# EAGLE design evalboard (EAGLE 7.2.0)
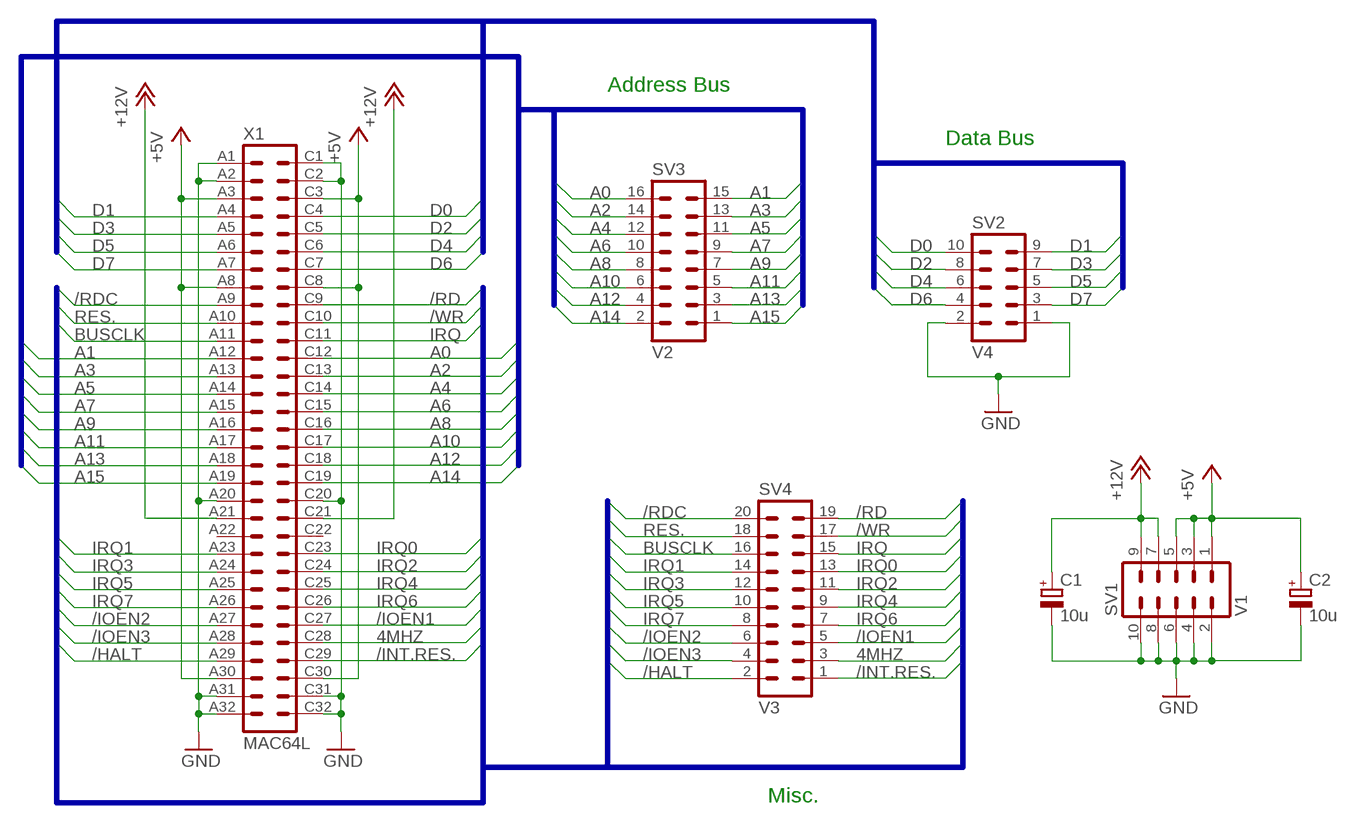
[diagram p0: schematic, sheet 1]

## Parts
C1  10u  CPOL-EUE2.5-5  [E2,5-5]
C2  10u  CPOL-EUE2.5-5  [E2,5-5]
SV1  V1  ML10L  [ML10L]
SV2  V4  ML10L  [ML10L]
SV3  V2  ML16L  [ML16L]
SV4  V3  ML20L  [ML20L]
X1  MAC64L  [MAC64L]

## Nets
4MHZ: SV4.3 X1.C28
+5V: C2.+ SV1.1 SV1.3 SV1.5 X1.A3 X1.A8 X1.A30 X1.C3 X1.C8 X1.C30
+12V: C1.+ SV1.7 SV1.9 X1.A21 X1.C21
/HALT: SV4.2 X1.A29
/INT.RES.: SV4.1 X1.C29
/IOEN1: SV4.5 X1.C27
/IOEN2: SV4.6 X1.A27
/IOEN3: SV4.4 X1.A28
/RD: SV4.19 X1.C9
/RDC: SV4.20 X1.A9
/WR: SV4.17 X1.C10
A0: SV3.16 X1.C12
A1: SV3.15 X1.A12
A2: SV3.14 X1.C13
A3: SV3.13 X1.A13
A4: SV3.12 X1.C14
A5: SV3.11 X1.A14
A6: SV3.10 X1.C15
A7: SV3.9 X1.A15
A8: SV3.8 X1.C16
A9: SV3.7 X1.A16
A10: SV3.6 X1.C17
A11: SV3.5 X1.A17
A12: SV3.4 X1.C18
A13: SV3.3 X1.A18
A14: SV3.2 X1.C19
A15: SV3.1 X1.A19
BUSCLK: SV4.16 X1.A11
D0: SV2.10 X1.C4
D1: SV2.9 X1.A4
D2: SV2.8 X1.C5
D3: SV2.7 X1.A5
D4: SV2.6 X1.C6
D5: SV2.5 X1.A6
D6: SV2.4 X1.C7
D7: SV2.3 X1.A7
GND: C1.- C2.- SV1.2 SV1.4 SV1.6 SV1.8 SV1.10 SV2.1 SV2.2 X1.A1 X1.A2 X1.A20 X1.A31 X1.A32 X1.C1 X1.C2 X1.C20 X1.C31 X1.C32
IRQ: SV4.15 X1.C11
IRQ0: SV4.13 X1.C23
IRQ1: SV4.14 X1.A23
IRQ2: SV4.11 X1.C24
IRQ3: SV4.12 X1.A24
IRQ4: SV4.9 X1.C25
IRQ5: SV4.10 X1.A25
IRQ6: SV4.7 X1.C26
IRQ7: SV4.8 X1.A26
RES.: SV4.18 X1.A10
Unconnected: X1.A22 X1.C22

## Buses
A[0..15]
D[0..7]
/RDC,/RD,RES.,/WR,BUSCLK,IRQ,IRQ[0..7],/IOEN[1..3],4MHZ,/HALT,/INT.RES.

## Notes on the sheet
- Address Bus
- Data Bus
- Misc.

## Library data of the parts
C1 C2 = rcl:CPOL-EU: POLARIZED CAPACITOR, European symbol
SV1 SV2 = con-harting-ml:ML10: HARTING; OC_FARNELL: unknown; OC_NEWARK: unknown
SV3 = con-harting-ml:ML16: HARTING; OC_FARNELL: unknown; OC_NEWARK: unknown
SV4 = con-harting-ml:ML20: HARTING; OC_FARNELL: unknown; OC_NEWARK: unknown
X1 = con-vg:MAC64L: CONNECTOR male, 64 pins, block, type C, rows AC, grid 5.08 mm

## Board
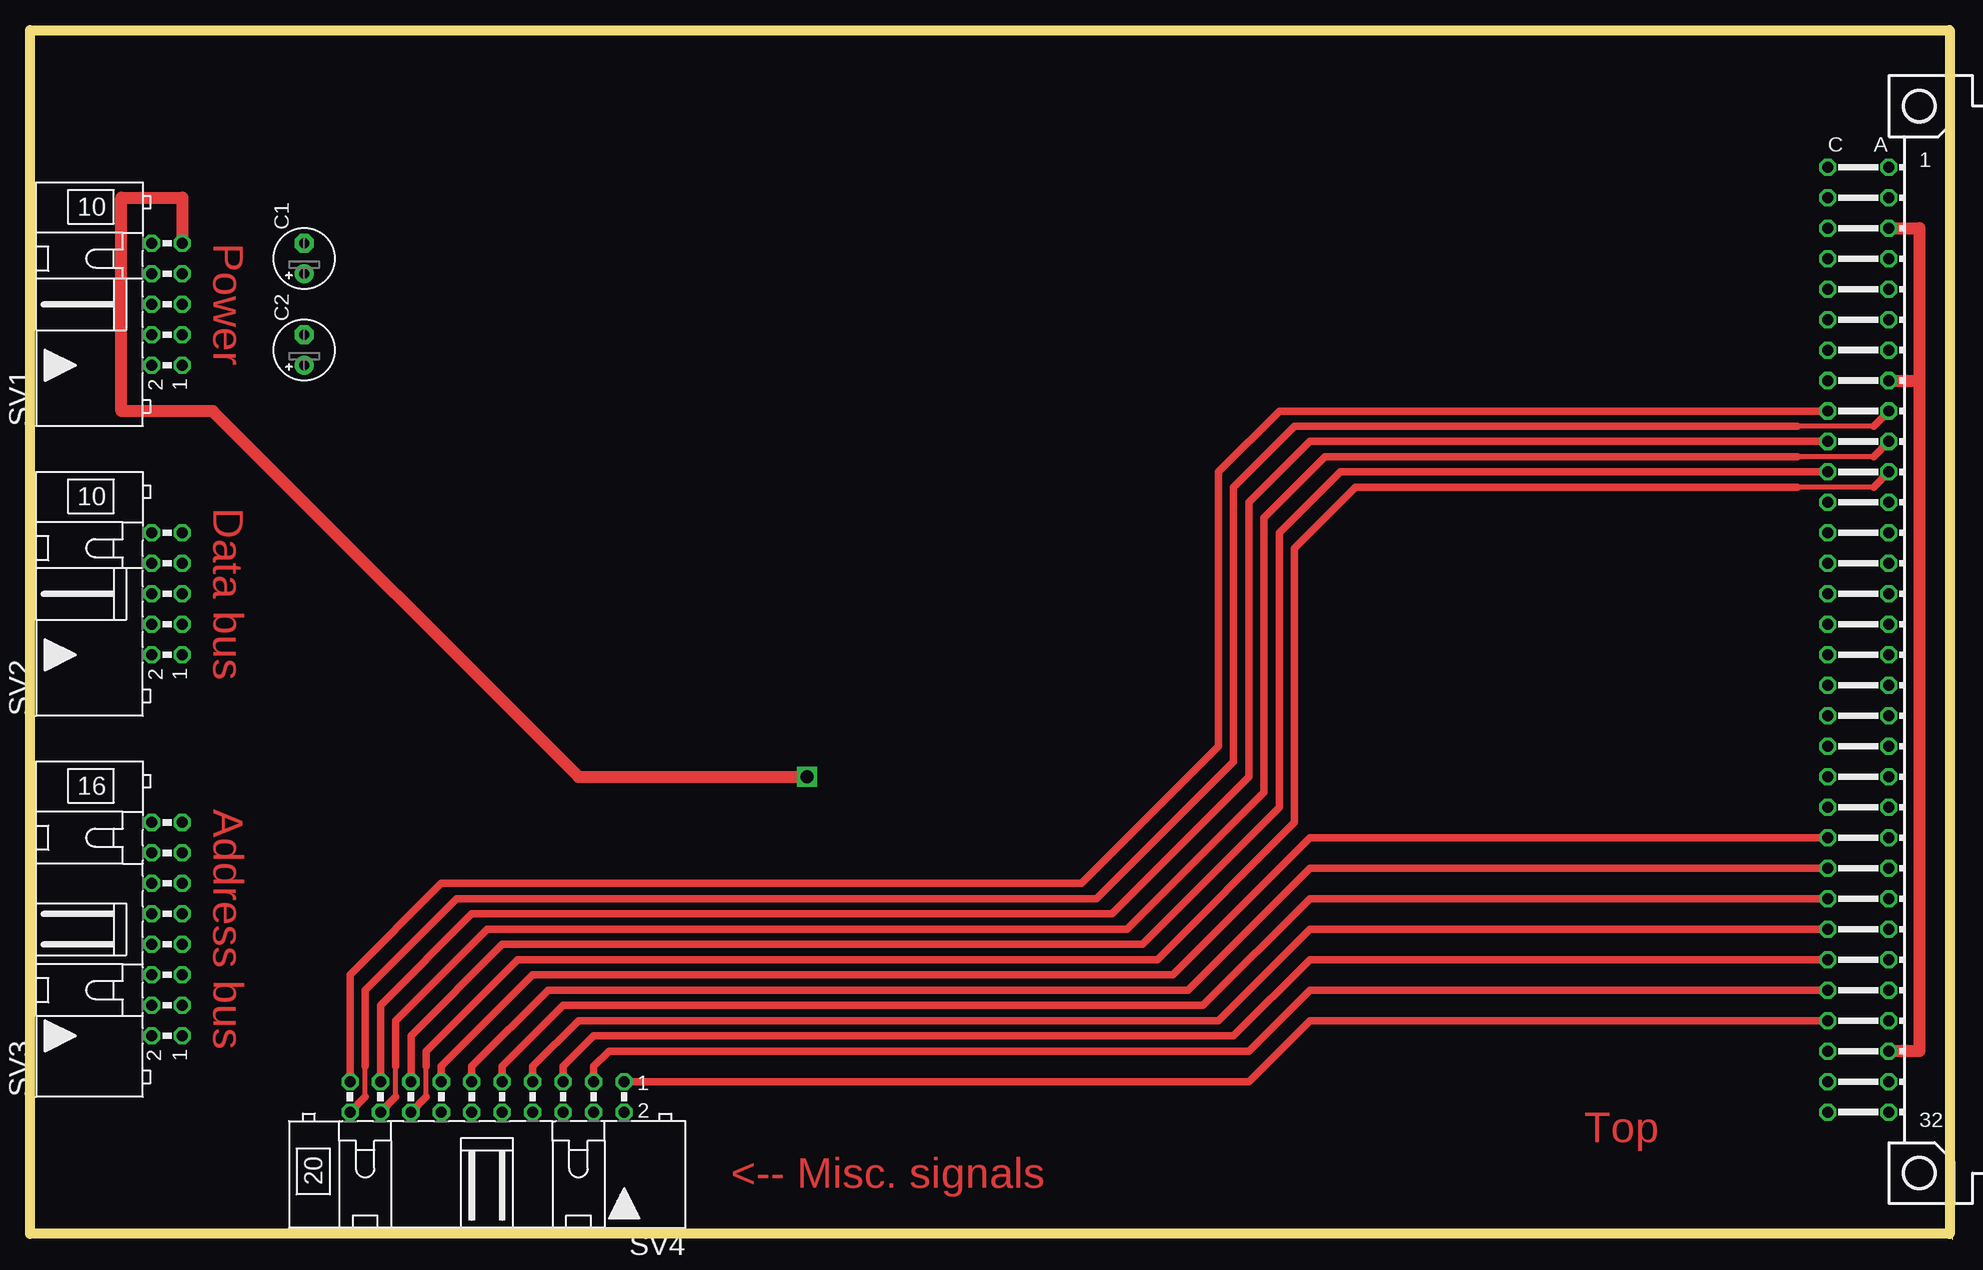
[diagram p1: board, top side]
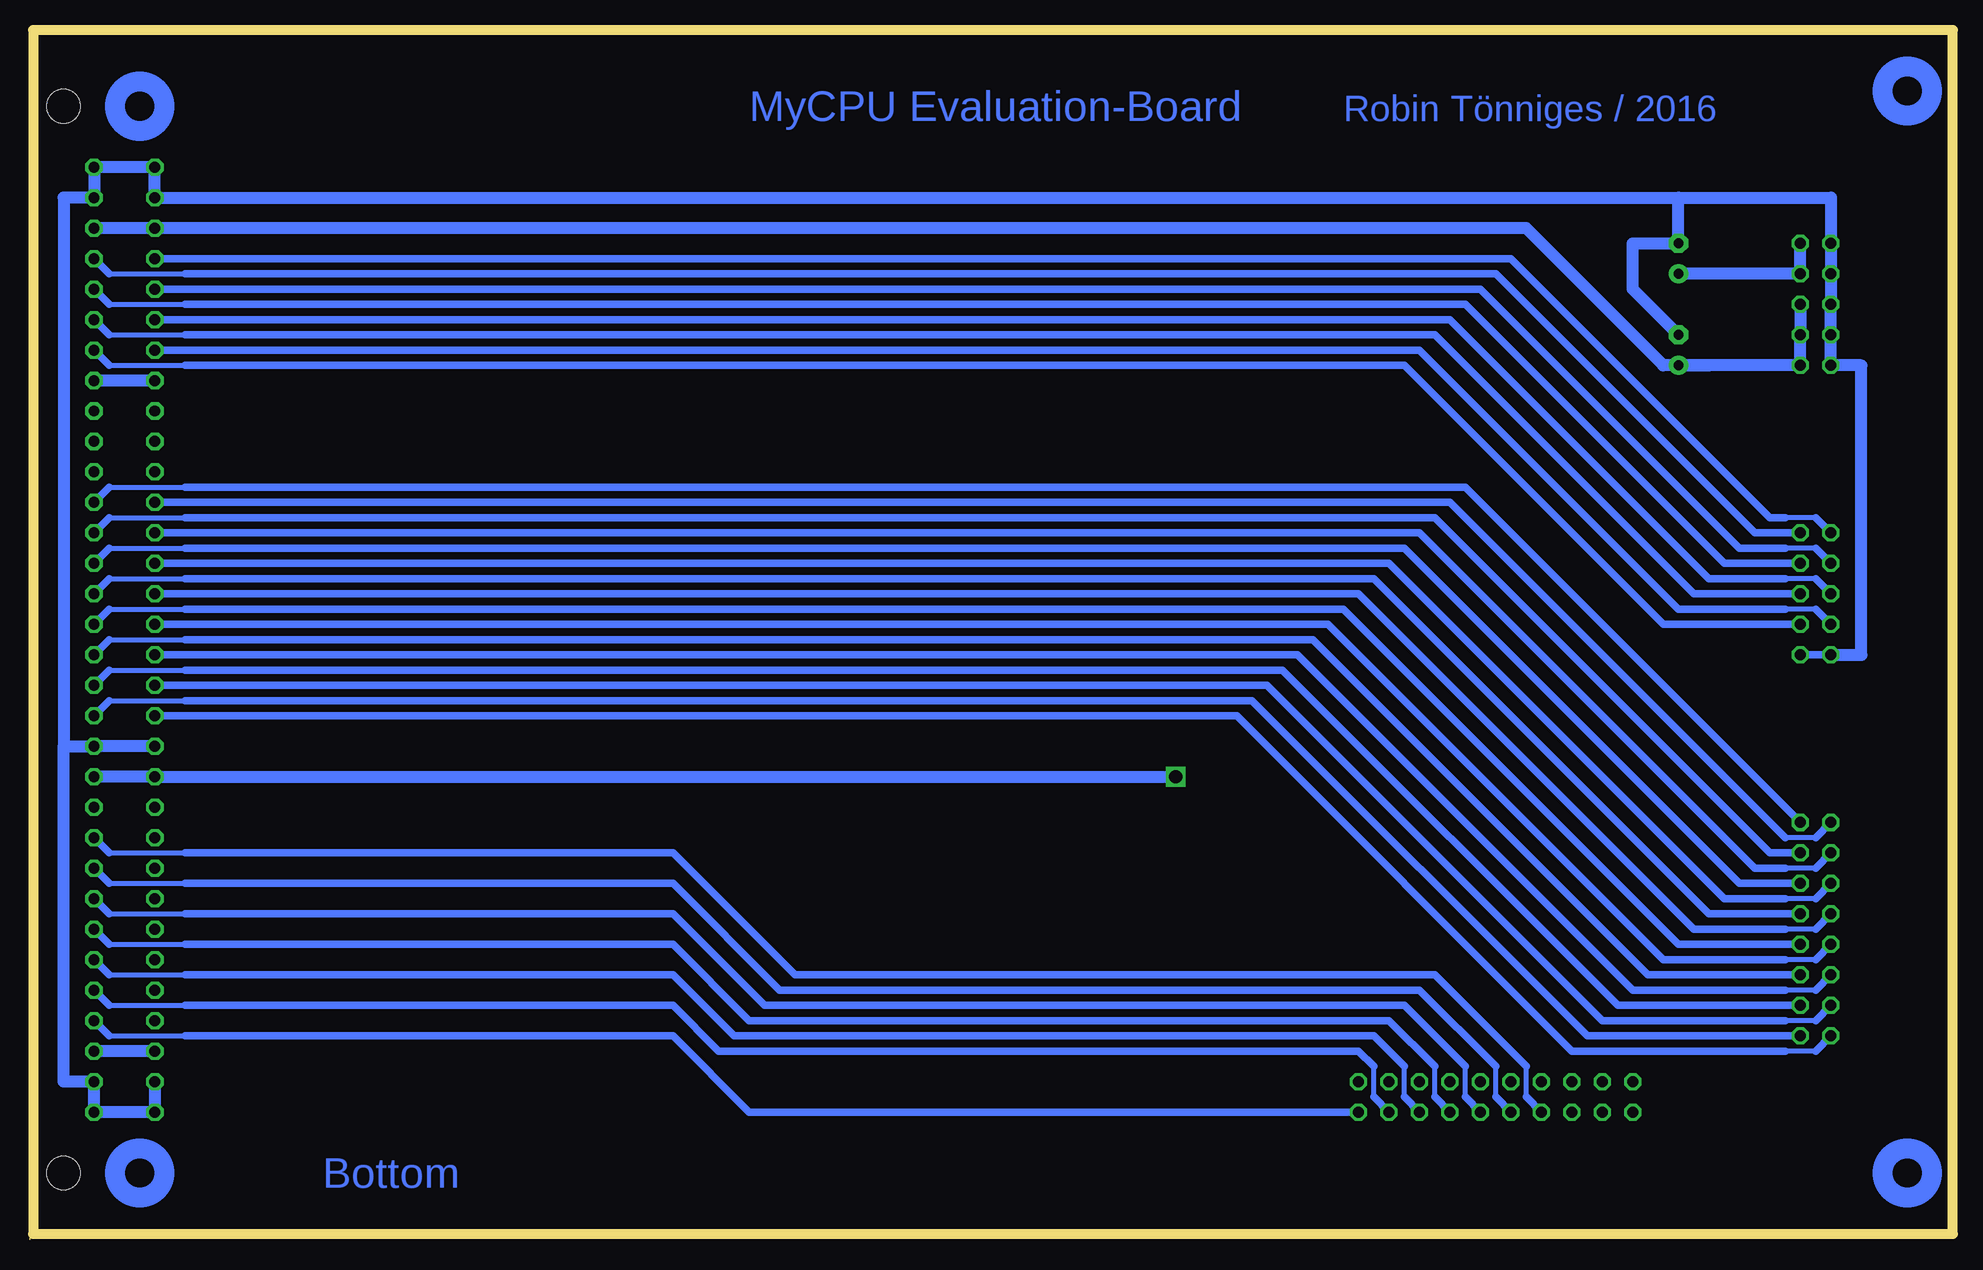
[diagram p2: board, bottom side, seen from below]

Size 160.02 x 100.33 mm. Coordinates in mm from the lower left corner, seen from the top.
Outline: 0,0 0,100.33 160.02,100.33 160.02,0 0,0
Copper layers (1*16): Top 0.035mm / dielectric 1.5mm / Bottom 0.035mm
Design rules "default": minimum track width 10mil, minimum drill 24mil, track to track 8mil, track to pad 8mil, pad to pad 8mil, via to via 8mil, smd to smd 8mil, copper to edge 40mil, drill to drill 8mil, minimum pad ring 10mil, minimum via ring 8mil, stop-mask expansion 4mil, vias tented up to drill 0mil, thermal gap 10mil

### Footprints (pad centres in the part's own frame; a part is rotated, then mirrored left to right if it is on the bottom)
E2,5-5 = drill 0.813 pad 1.6: + -1.27,0 | drill 0.813 pad 1.6 octagon: - 1.27,0
ML10L = drill 0.914 octagon: 1 -5.08,-1.27; 2 -5.08,1.27; 3 -2.54,-1.27; 4 -2.54,1.27; 5 0,-1.27; 6 0,1.27; 7 2.54,-1.27; 8 2.54,1.27; 9 5.08,-1.27; 10 5.08,1.27
ML16L = drill 0.914 octagon: 1 -8.89,-1.27; 2 -8.89,1.27; 3 -6.35,-1.27; 4 -6.35,1.27; 5 -3.81,-1.27; 6 -3.81,1.27; 7 -1.27,-1.27; 8 -1.27,1.27; 9 1.27,-1.27; 10 1.27,1.27; 11 3.81,-1.27; 12 3.81,1.27; 13 6.35,-1.27; 14 6.35,1.27; 15 8.89,-1.27; 16 8.89,1.27
ML20L = drill 0.914 octagon: 1 -11.43,-1.27; 2 -11.43,1.27; 3 -8.89,-1.27; 4 -8.89,1.27; 5 -6.35,-1.27; 6 -6.35,1.27; 7 -3.81,-1.27; 8 -3.81,1.27; 9 -1.27,-1.27; 10 -1.27,1.27; 11 1.27,-1.27; 12 1.27,1.27; 13 3.81,-1.27; 14 3.81,1.27; 15 6.35,-1.27; 16 6.35,1.27; 17 8.89,-1.27; 18 8.89,1.27; 19 11.43,-1.27; 20 11.43,1.27
MAC64L = drill 0.914 octagon: A1 -2.54,39.37; A2 -2.54,36.83; A3 -2.54,34.29; A4 -2.54,31.75; A5 -2.54,29.21; A6 -2.54,26.67; A7 -2.54,24.13; A8 -2.54,21.59; A9 -2.54,19.05; A10 -2.54,16.51; A11 -2.54,13.97; A12 -2.54,11.43; A13 -2.54,8.89; A14 -2.54,6.35; A15 -2.54,3.81; A16 -2.54,1.27; A17 -2.54,-1.27; A18 -2.54,-3.81; A19 -2.54,-6.35; A20 -2.54,-8.89; A21 -2.54,-11.43; A22 -2.54,-13.97; A23 -2.54,-16.51; A24 -2.54,-19.05; A25 -2.54,-21.59; A26 -2.54,-24.13; A27 -2.54,-26.67; A28 -2.54,-29.21; A29 -2.54,-31.75; A30 -2.54,-34.29; A31 -2.54,-36.83; A32 -2.54,-39.37; C1 -7.62,39.37; C2 -7.62,36.83; C3 -7.62,34.29; C4 -7.62,31.75; C5 -7.62,29.21; C6 -7.62,26.67; C7 -7.62,24.13; C8 -7.62,21.59; C9 -7.62,19.05; C10 -7.62,16.51; C11 -7.62,13.97; C12 -7.62,11.43; C13 -7.62,8.89; C14 -7.62,6.35; C15 -7.62,3.81; C16 -7.62,1.27; C17 -7.62,-1.27; C18 -7.62,-3.81; C19 -7.62,-6.35; C20 -7.62,-8.89; C21 -7.62,-11.43; C22 -7.62,-13.97; C23 -7.62,-16.51; C24 -7.62,-19.05; C25 -7.62,-21.59; C26 -7.62,-24.13; C27 -7.62,-26.67; C28 -7.62,-29.21; C29 -7.62,-31.75; C30 -7.62,-34.29; C31 -7.62,-36.83; C32 -7.62,-39.37 | hole 2.794: 0,44.45; 0,-44.45

### Placement (x,y rotation side)
C1  22.86,81.28 90 top
C2  22.86,73.66 90 top
SV1  11.43,77.47 90 top
SV2  11.43,53.34 90 top
SV3  11.43,25.4 90 top
SV4  38.1,11.43 180 top
X1  157.48,49.53 0 top

### Tracks (layer width: path | path; a pad name or v marks a point on that pad's centre or on a via)
4MHZ
  Top 0.61: SV4.3 46.99,13.97 48.26,15.24 101.6,15.24 106.68,20.32 X1.C28
+5V
  Top 1.016: X1.A3 157.48,83.82 157.48,71.12 | 157.48,71.12 157.48,15.24 X1.A30 | X1.A8 157.48,71.12
  Bottom 1.016: SV1.5 SV1.3 SV1.1 C2.+ | X1.A3 X1.C3 35.56,83.82 24.13,72.39 C2.+ | X1.C30 X1.A30 | X1.C8 X1.A8 | C2.+ 20.32,72.39
+12V  (via drill 1.1)
  Top 1.016: v64.77,38.1 45.72,38.1 15.24,68.58 7.62,68.58 7.62,86.36 12.7,86.36 SV1.9
  Bottom 1.016: SV1.9 SV1.7 C1.+ | X1.A21 X1.C21 v64.77,38.1
/HALT
  Bottom 0.406: 153.67,16.51 147.32,16.51
  Bottom 0.61: SV4.2 100.33,10.16 106.68,16.51 147.32,16.51 | 153.67,16.51 X1.A29
/INT.RES.
  Top 0.61: SV4.1 101.6,12.7 106.68,17.78 X1.C29
/IOEN1
  Top 0.61: SV4.5 44.45,13.97 46.99,16.51 100.33,16.51 106.68,22.86 X1.C27
/IOEN2
  Bottom 0.406: 153.67,21.59 147.32,21.59 | 45.72,11.43 45.72,13.97
  Bottom 0.61: SV4.6 45.72,11.43 | 45.72,13.97 48.26,16.51 101.6,16.51 106.68,21.59 147.32,21.59 | 153.67,21.59 X1.A27
/IOEN3
  Bottom 0.406: 153.67,19.05 147.32,19.05 | 48.26,11.43 48.26,13.97
  Bottom 0.61: SV4.4 48.26,11.43 | 48.26,13.97 49.53,15.24 102.87,15.24 106.68,19.05 147.32,19.05 | 153.67,19.05 X1.A28
/RD
  Top 0.61: SV4.19 26.67,21.59 34.29,29.21 87.63,29.21 99.06,40.64 99.06,63.5 104.14,68.58 X1.C9
/RDC
  Top 0.406: 153.67,67.31 147.32,67.31 | 27.94,11.43 27.94,13.97
  Top 0.61: SV4.20 27.94,11.43 | 153.67,67.31 X1.A9 | 147.32,67.31 105.41,67.31 100.33,62.23 100.33,39.37 88.9,27.94 35.56,27.94 27.94,20.32 27.94,13.97
/WR
  Top 0.61: SV4.17 29.21,19.05 36.83,26.67 90.17,26.67 101.6,38.1 101.6,60.96 106.68,66.04 X1.C10
A0
  Bottom 0.406: 11.43,33.02 13.97,33.02
  Bottom 0.61: SV3.16 11.43,33.02 | 13.97,33.02 41.91,60.96 X1.C12
A1
  Bottom 0.406: 153.67,62.23 147.32,62.23
  Bottom 0.61: SV3.15 40.64,62.23 147.32,62.23 | 153.67,62.23 X1.A12
A2
  Bottom 0.406: 11.43,30.48 13.97,30.48
  Bottom 0.61: SV3.14 11.43,30.48 | X1.C13 44.45,58.42 16.51,30.48 13.97,30.48
A3
  Bottom 0.406: 153.67,59.69 147.32,59.69
  Bottom 0.61: SV3.13 15.24,31.75 43.18,59.69 147.32,59.69 | 153.67,59.69 X1.A13
A4
  Bottom 0.406: 11.43,27.94 13.97,27.94
  Bottom 0.61: SV3.12 11.43,27.94 | X1.C14 46.99,55.88 19.05,27.94 13.97,27.94
A5
  Bottom 0.406: 153.67,57.15 147.32,57.15
  Bottom 0.61: SV3.11 17.78,29.21 45.72,57.15 147.32,57.15 | 153.67,57.15 X1.A14
A6
  Bottom 0.406: 11.43,25.4 13.97,25.4
  Bottom 0.61: SV3.10 11.43,25.4 | X1.C15 49.53,53.34 21.59,25.4 13.97,25.4
A7
  Bottom 0.406: 153.67,54.61 147.32,54.61
  Bottom 0.61: SV3.9 20.32,26.67 48.26,54.61 147.32,54.61 | 153.67,54.61 X1.A15
A8
  Bottom 0.406: 11.43,22.86 13.97,22.86
  Bottom 0.61: SV3.8 11.43,22.86 | X1.C16 52.07,50.8 24.13,22.86 13.97,22.86
A9
  Bottom 0.406: 153.67,52.07 147.32,52.07
  Bottom 0.61: SV3.7 22.86,24.13 50.8,52.07 147.32,52.07 | 153.67,52.07 X1.A16
A10
  Bottom 0.406: 11.43,20.32 13.97,20.32
  Bottom 0.61: SV3.6 11.43,20.32 | X1.C17 54.61,48.26 26.67,20.32 13.97,20.32
A11
  Bottom 0.406: 153.67,49.53 147.32,49.53
  Bottom 0.61: SV3.5 25.4,21.59 53.34,49.53 147.32,49.53 | 153.67,49.53 X1.A17
A12
  Bottom 0.406: 11.43,17.78 13.97,17.78
  Bottom 0.61: SV3.4 11.43,17.78 | X1.C18 57.15,45.72 29.21,17.78 13.97,17.78
A13
  Bottom 0.406: 153.67,46.99 147.32,46.99
  Bottom 0.61: SV3.3 27.94,19.05 55.88,46.99 147.32,46.99 | 153.67,46.99 X1.A18
A14
  Bottom 0.406: 11.43,15.24 13.97,15.24
  Bottom 0.61: SV3.2 11.43,15.24 | X1.C19 59.69,43.18 31.75,15.24 13.97,15.24
A15
  Bottom 0.406: 153.67,44.45 147.32,44.45
  Bottom 0.61: SV3.1 30.48,16.51 58.42,44.45 147.32,44.45 | 153.67,44.45 X1.A19
BUSCLK
  Top 0.406: 153.67,62.23 147.32,62.23 | 33.02,11.43 33.02,13.97
  Top 0.61: SV4.16 33.02,11.43 | 153.67,62.23 X1.A11 | 147.32,62.23 110.49,62.23 105.41,57.15 105.41,34.29 93.98,22.86 40.64,22.86 33.02,15.24 33.02,13.97
D0
  Bottom 0.406: 11.43,59.69 13.97,59.69
  Bottom 0.61: SV2.10 11.43,59.69 | X1.C4 36.83,81.28 15.24,59.69 13.97,59.69
D1
  Bottom 0.406: 153.67,80.01 147.32,80.01
  Bottom 0.61: SV2.9 16.51,58.42 38.1,80.01 147.32,80.01 | 153.67,80.01 X1.A4
D2
  Bottom 0.406: 11.43,57.15 13.97,57.15
  Bottom 0.61: SV2.8 11.43,57.15 | X1.C5 39.37,78.74 17.78,57.15 13.97,57.15
D3
  Bottom 0.406: 153.67,77.47 147.32,77.47
  Bottom 0.61: SV2.7 19.05,55.88 40.64,77.47 147.32,77.47 | 153.67,77.47 X1.A5
D4
  Bottom 0.406: 11.43,54.61 13.97,54.61
  Bottom 0.61: SV2.6 11.43,54.61 | X1.C6 41.91,76.2 20.32,54.61 13.97,54.61
D5
  Bottom 0.406: 153.67,74.93 147.32,74.93
  Bottom 0.61: SV2.5 21.59,53.34 43.18,74.93 147.32,74.93 | 153.67,74.93 X1.A6
D6
  Bottom 0.406: 11.43,52.07 13.97,52.07
  Bottom 0.61: SV2.4 11.43,52.07 | X1.C7 44.45,73.66 22.86,52.07 13.97,52.07
D7
  Bottom 0.406: 153.67,72.39 147.32,72.39
  Bottom 0.61: SV2.3 24.13,50.8 45.72,72.39 147.32,72.39 | 153.67,72.39 X1.A7
GND
  Bottom 0.61: SV2.1 SV2.2
  Bottom 1.016: SV2.2 7.62,48.26 7.62,72.39 SV1.2 SV1.4 SV1.6 SV1.8 SV1.10 10.16,86.36 22.86,86.36 | 157.48,40.64 157.48,86.36 X1.A2 X1.A1 X1.C1 X1.C2 22.86,86.36 | 157.48,40.64 X1.A20 X1.C20 | 157.48,40.64 157.48,12.7 X1.A31 X1.A32 X1.C32 X1.C31 | 22.86,86.36 C1.- 26.67,82.55 26.67,78.74 C2.-
IRQ
  Top 0.61: SV4.15 31.75,16.51 39.37,24.13 92.71,24.13 104.14,35.56 104.14,58.42 109.22,63.5 X1.C11
IRQ0
  Top 0.61: SV4.13 34.29,13.97 41.91,21.59 95.25,21.59 106.68,33.02 X1.C23
IRQ1
  Bottom 0.406: 153.67,31.75 147.32,31.75 | 35.56,11.43 35.56,13.97
  Bottom 0.61: SV4.14 35.56,11.43 | 35.56,13.97 43.18,21.59 96.52,21.59 106.68,31.75 147.32,31.75 | 153.67,31.75 X1.A23
IRQ2
  Top 0.61: SV4.11 36.83,13.97 43.18,20.32 96.52,20.32 106.68,30.48 X1.C24
IRQ3
  Bottom 0.406: 153.67,29.21 147.32,29.21 | 38.1,11.43 38.1,13.97
  Bottom 0.61: SV4.12 38.1,11.43 | 38.1,13.97 44.45,20.32 97.79,20.32 106.68,29.21 147.32,29.21 | 153.67,29.21 X1.A24
IRQ4
  Top 0.61: SV4.9 39.37,13.97 44.45,19.05 97.79,19.05 106.68,27.94 X1.C25
IRQ5
  Bottom 0.406: 153.67,26.67 147.32,26.67 | 40.64,11.43 40.64,13.97
  Bottom 0.61: SV4.10 40.64,11.43 | 40.64,13.97 45.72,19.05 99.06,19.05 106.68,26.67 147.32,26.67 | 153.67,26.67 X1.A25
IRQ6
  Top 0.61: SV4.7 41.91,13.97 45.72,17.78 99.06,17.78 106.68,25.4 X1.C26
IRQ7
  Bottom 0.406: 153.67,24.13 147.32,24.13 | 43.18,11.43 43.18,13.97
  Bottom 0.61: SV4.8 43.18,11.43 | 43.18,13.97 46.99,17.78 100.33,17.78 106.68,24.13 147.32,24.13 | 153.67,24.13 X1.A26
N$1
  cutout Bottom (no thermals): 0,0 160.02,0 160.02,100.01 0,100.01
N$2
  cutout Top (no thermals): 0,0 0,100.01 160.02,100.01 160.02,0
RES.
  Top 0.406: 153.67,64.77 147.32,64.77 | 30.48,11.43 30.48,13.97
  Top 0.61: SV4.18 30.48,11.43 | 153.67,64.77 X1.A10 | 147.32,64.77 107.95,64.77 102.87,59.69 102.87,36.83 91.44,25.4 38.1,25.4 30.48,17.78 30.48,13.97
(copper drawn outside any net)
  shapes: Bottom circle x4

### Text on the board
Top: Power | Data bus | Address bus | Top | <-- Misc. signals
Bottom: Robin Tönniges / 2016 | MyCPU Evaluation-Board | Bottom